# EAGLE design salumi (EAGLE 6.4)
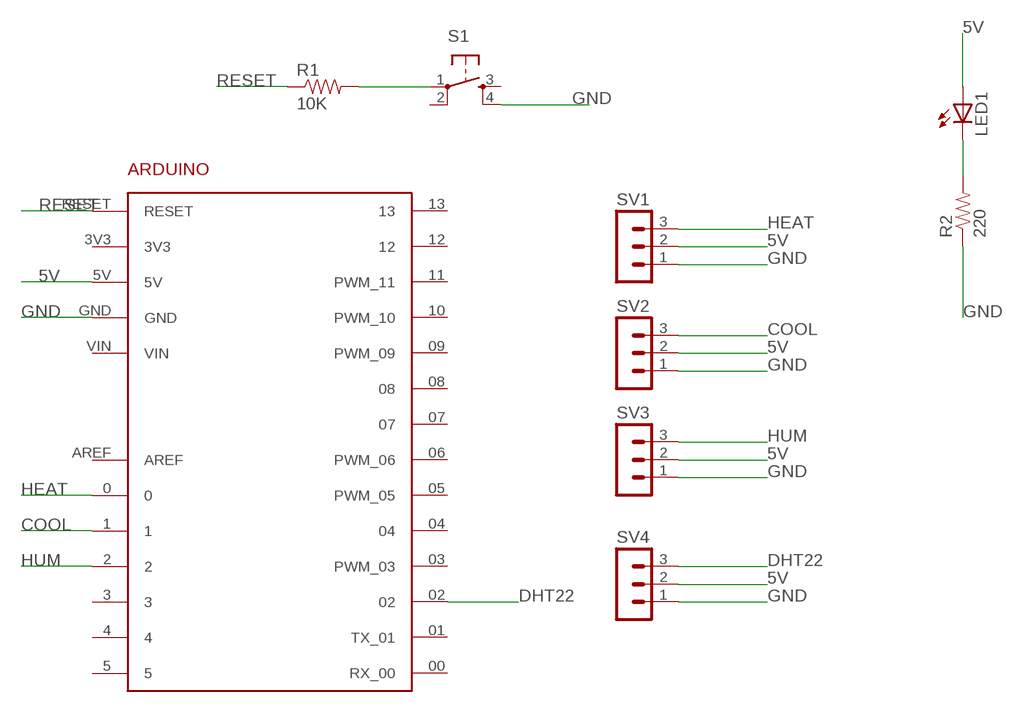
[diagram p0: schematic, sheet 1]

## Parts
ARDUINO1  ARDUINO  [ARDUINO]
LED1  LED5MM  [LED5MM]
R1  10K  RESISTORAXIAL-0.3  [AXIAL-0.3]
R2  220  RESISTORAXIAL-0.3  [AXIAL-0.3]
S1  TAC_SWITCHPTH  [TACTILE-PTH]
SV1  MA03-1  [MA03-1]
SV2  MA03-1  [MA03-1]
SV3  MA03-1  [MA03-1]
SV4  MA03-1  [MA03-1]

## Nets
5V: ARDUINO1.5V LED1.A SV1.2 SV2.2 SV3.2 SV4.2
COOL: ARDUINO1.1 SV2.3
DHT22: ARDUINO1.02 SV4.3
GND: ARDUINO1.GND R2.P$1 S1.4 SV1.1 SV2.1 SV3.1 SV4.1
HEAT: ARDUINO1.0 SV1.3
HUM: ARDUINO1.2 SV3.3
N$1: R1.P$2 S1.1
N$2: LED1.K(C) R2.P$2
RESET: ARDUINO1.RESET R1.P$1
Unconnected: ARDUINO1.00(RX_00) ARDUINO1.01(TX_01) ARDUINO1.3 ARDUINO1.03(PWM_03) ARDUINO1.3V3 ARDUINO1.4 ARDUINO1.04 ARDUINO1.5 ARDUINO1.05(PWM_05) ARDUINO1.06(PWM_06) ARDUINO1.07 ARDUINO1.08 ARDUINO1.09(PWM_09) ARDUINO1.10(PWM_10) ARDUINO1.11(PWM_11) ARDUINO1.12 ARDUINO1.13 ARDUINO1.AREF ARDUINO1.VIN S1.2 S1.3

## Library data of the parts
ARDUINO1 = arduino:ARDUINO: For creating Arduino shields
LED1 = led:LED: LED OSRAM: - CHIPLED LG R971, LG N971, LY N971, LG Q971, LY Q971, LO R971, LY R971 LH N974, LH R974 LS Q976, LO Q976, LY Q976 LO Q996 - Hyper CHIPLED LW Q18S LB Q993, LB Q99A, LB R99A - SideLED LS A670, LO A670, LY A670, LG A670, LP A670 LB A673, LV A673, LT A673, LW A673 LH A674 LY A675 LS A676, LA A676, LO A676, LY A676, LW A676 LS A679, LY A679, LG A679 - Hyper Micro SIDELED® LS Y876, LA Y876, LO Y876, LY Y876 LT Y87S - SmartLED LW L88C, LW L88S LB L89C, LB L89S, LG L890 LS L89K, LO L89K, LY L89K LS L896, LA L896, LO L896, LY L896 - TOPLED LS T670, LO T670, LY T670, LG T670, LP T670 LSG T670, LSP T670, LSY T670, LOP T670, LYG T670 LG T671, LOG T671, LSG T671 LB T673, LV T673, LT T673, LW T673 LH T674 LS T676, LA T676, LO T676, LY T676, LB T676, LH T676, LSB T676, LW T676 LB T67C, LV T67C, LT T67C, LS T67K, LO T67K, LY T67K, LW E67C LS E67B, LA E67B, LO E67B, LY E67B, LB E67C, LV E67C, LT E67C LW T67C LS T679, LY T679, LG T679 LS T770, LO T770, LY T770, LG T770, LP T770 LB T773, LV T773, LT T773, LW T773 LH T774 LS E675, LA E675, LY E675, LS T675 LS T776, LA T776, LO T776, LY T776, LB T776 LHGB T686 LT T68C, LB T68C - Hyper Mini TOPLED® LB M676 - Mini TOPLED Santana® LG M470 LS M47K, LO M47K, LY M47K Source: http://www.osram.convergy.de LUXEON: - LUMILED® LXK2-PW12-R00, LXK2-PW12-S00, LXK2-PW14-U00, LXK2-PW14-V00 LXK2-PM12-R00, LXK2-PM12-S00, LXK2-PM14-U00 LXK2-PE12-Q00, LXK2-PE12-R00, LXK2-PE12-S00, LXK2-PE14-T00, LXK2-PE14-U00 LXK2-PB12-K00, LXK2-PB12-L00, LXK2-PB12-M00, LXK2-PB14-N00, LXK2-PB14-P00, LXK2-PB14-Q00 LXK2-PR12-L00, LXK2-PR12-M00, LXK2-PR14-Q00, LXK2-PR14-R00 LXK2-PD12-Q00, LXK2-PD12-R00, LXK2-PD12-S00 LXK2-PH12-R00, LXK2-PH12-S00 LXK2-PL12-P00, LXK2-PL12-Q00, LXK2-PL12-R00 Source: www.luxeon.com KINGBRIGHT: KA-3528ASYC Source: www.kingbright.com
R1 R2 = SparkFun-Resistors:RESISTOR: Resistor Basic schematic elements and footprints for 0603, 1206, and PTH resistors.
S1 = SparkFun-Electromechanical:TAC_SWITCH: Momentary Switch Button commonly used for reset or general input. Spark Fun Electronics SKU : COM-00097 SMT- SWCH-08247
SV1-SV4 = con-lstb:MA03-1: PIN HEADER; OC_FARNELL: unknown; OC_NEWARK: unknown

## Board
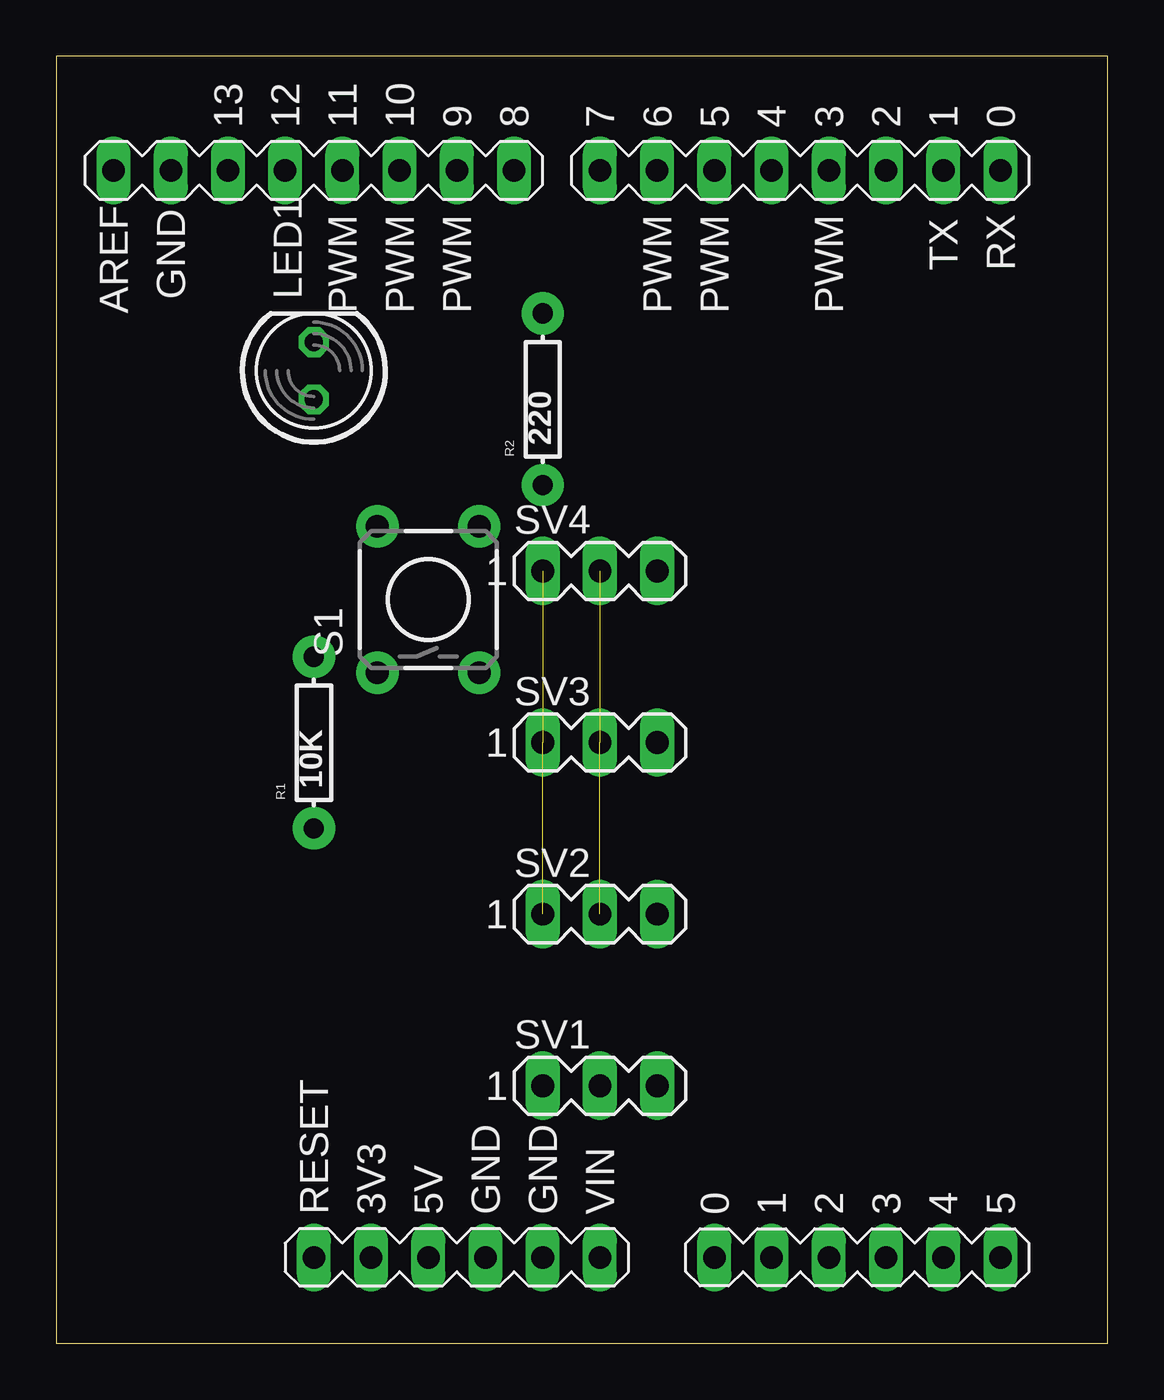
[diagram p1: board, top side]
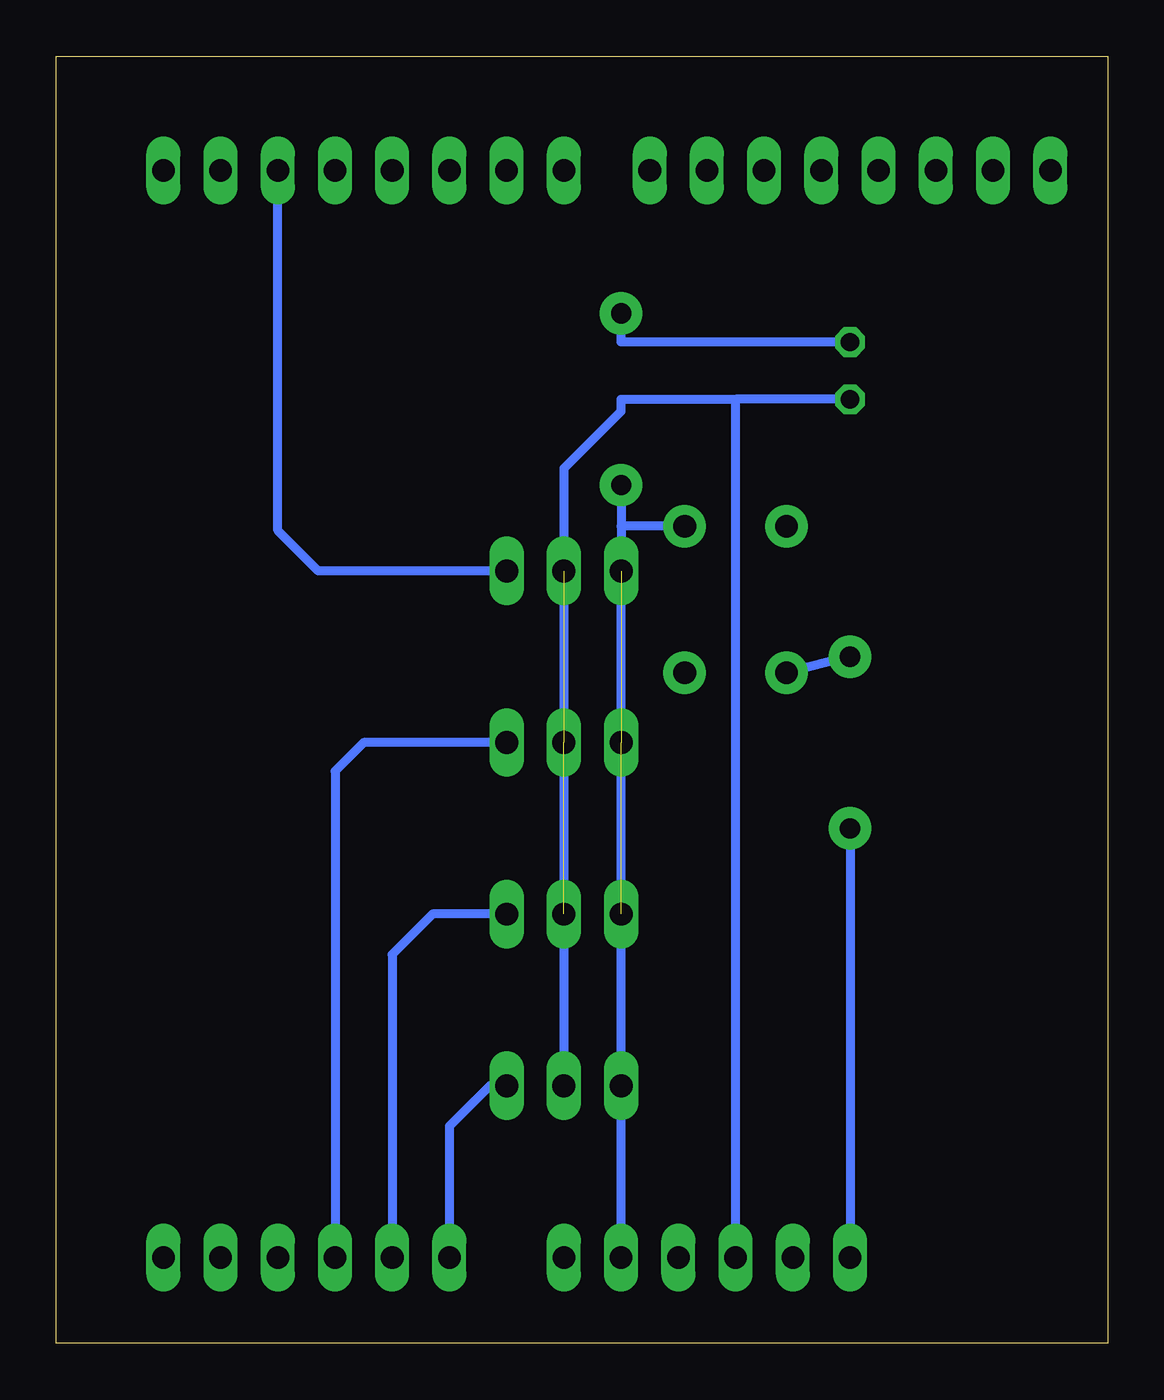
[diagram p2: board, bottom side, seen from below]

Size 46.66 x 57.14 mm. Coordinates in mm from the lower left corner, seen from the top.
Outline: 0,0 46.66,0 46.66,57.14 0,57.14 0,0
Copper layers (1*16): Top 0.035mm / dielectric 1.5mm / Bottom 0.035mm
Design rules "default": minimum track width 10mil, minimum drill 24mil, track to track 8mil, track to pad 8mil, pad to pad 8mil, via to via 8mil, smd to smd 8mil, copper to edge 40mil, drill to drill 8mil, minimum pad ring 10mil, minimum via ring 8mil, stop-mask expansion 4mil, vias tented up to drill 0mil, thermal gap 10mil

### Footprints (pad centres in the part's own frame; a part is rotated, then mirrored left to right if it is on the bottom)
ARDUINO = drill 1 long: 00 25.4,-20.32; 0 -22.86,-7.62; 01 25.4,-17.78; 1 -22.86,-10.16; 02 25.4,-15.24; 2 -22.86,-12.7; 03 25.4,-12.7; 3 -22.86,-15.24; 3V3 -22.86,7.62; 04 25.4,-10.16; 4 -22.86,-17.78; 05 25.4,-7.62; 5 -22.86,-20.32; 5V -22.86,5.08; 06 25.4,-5.08; 07 25.4,-2.54; 08 25.4,1.27; 09 25.4,3.81; 10 25.4,6.35; 11 25.4,8.89; 12 25.4,11.43; 13 25.4,13.97; AREF 25.4,19.05; GND -22.86,0; GND2 -22.86,2.54; GND3 25.4,16.51; RESET -22.86,10.16; VIN -22.86,-2.54
LED5MM = drill 0.813 octagon: A -1.27,0; K 1.27,0
AXIAL-0.3 = drill 0.9 pad 1.88: P$1 -3.81,0; P$2 3.81,0
TACTILE-PTH = drill 1.016 pad 1.88: 1 -3.251,2.261; 2 3.251,2.261; 3 -3.251,-2.261; 4 3.251,-2.261
MA03-1 = drill 1.016 long: 1 -2.54,0; 2 0,0; 3 2.54,0

### Placement (x,y rotation side)
ARDUINO1  21.59,26.67 90 top
LED1  11.43,43.18 90 top
R1  11.43,26.67 90 top
R2  21.59,41.91 90 top
S1  16.51,33.02 90 top
SV1  24.13,11.43 0 top
SV2  24.13,19.05 0 top
SV3  24.13,26.67 0 top
SV4  24.13,34.29 0 top

### Tracks (layer width: path | path; a pad name or v marks a point on that pad's centre or on a via)
5V  (2 unrouted)
  Bottom 0.406: ARDUINO1.5V 16.51,41.91 | SV1.2 SV4.2 24.13,38.84 21.59,41.38 21.59,41.91 16.51,41.91 | LED1.A 16.51,41.91
COOL
  Bottom 0.406: SV2.3 29.95,19.05 31.75,17.25 ARDUINO1.1
DHT22
  Bottom 0.406: SV4.3 35.03,34.29 36.83,36.09 ARDUINO1.02
GND  (2 unrouted)
  Bottom 0.406: ARDUINO1.GND SV1.1 SV4.1 21.59,36.27 | S1.4 21.59,36.27 | R2.P$1 21.59,36.27
HEAT
  Bottom 0.406: SV1.3 27.41,11.43 29.21,9.63 ARDUINO1.0
HUM
  Bottom 0.406: SV3.3 33.02,26.67 34.29,25.4 ARDUINO1.2
N$1
  Bottom 0.406: R1.P$2 S1.1
N$2
  Bottom 0.406: LED1.K 21.59,44.45 R2.P$2
RESET
  Bottom 0.406: R1.P$1 ARDUINO1.RESET